# EAGLE schematic distortion3 (EAGLE 8.5.1)
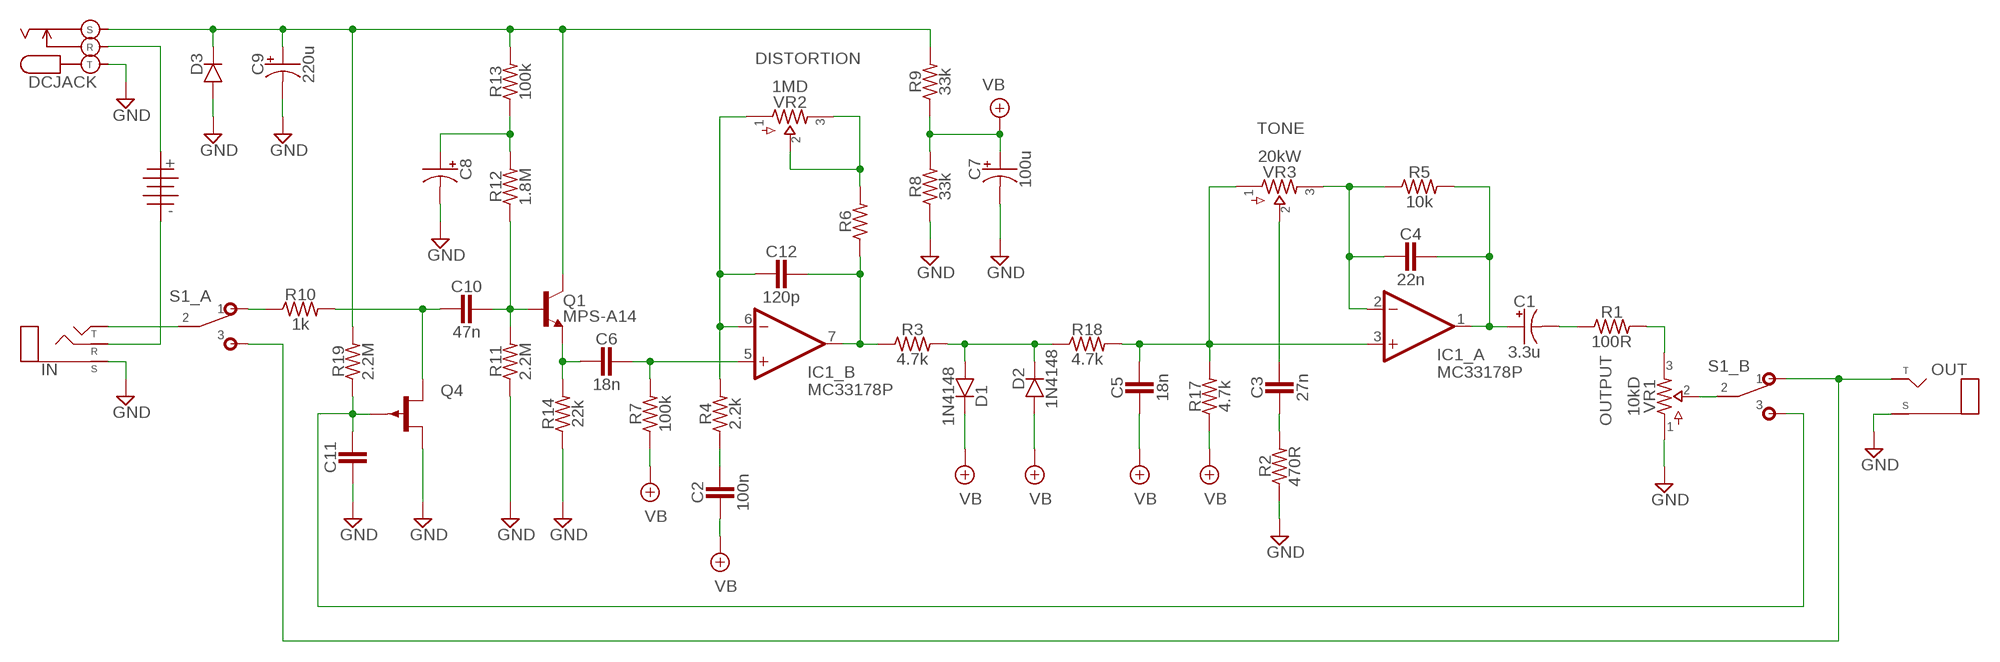
[diagram p0: schematic, sheet 1]

## Parts
BAT1  BATTERY  [TWO_PADS]
C1  3.3u  0500  [050_020]
C2  100n  CER/FILMBOX.1  [BOX_SMALL]
C3  27n  CER/FILMBOX.1  [BOX_SMALL]
C4  22n  CER/FILMBOX.1  [BOX_SMALL]
C5  18n  CER/FILMBOX.1  [BOX_SMALL]
C6  18n  CER/FILMBOX.1  [BOX_SMALL]
C7  100u  0500  [050_020]
C8  0500  [050_020]
C9  220u  0500  [050_020]
C10  47n  CER/FILMBOX.1  [BOX_SMALL]
C11  CER/FILMBOX.1  [BOX_SMALL]
C12  120p  CER/FILMBOX.1  [BOX_SMALL]
D1  1N4148  DO35.2  [DO35-2]
D2  1N4148  DO35.2  [DO35-2]
D3  DO35.2  [DO35-2]
DCJACK  DC_KOBICONN  [DC_KOBICONN]
IC1  MC33178P  DUALTH  [DIL0]
IN  STEREO  [STEREO_PCB]
OUT  MONO_JACK  [MONO_SW]
Q1  MPS-A14  2N3904  [TO92-]
Q4  2N3820  [TO92F]
R1  100R  R_.3B  [R0207/3]
R2  470R  R_.3B  [R0207/3]
R3  4.7k  R_.3B  [R0207/3]
R4  2.2k  R_.3B  [R0207/3]
R5  10k  R_.3B  [R0207/3]
R6  R_.3B  [R0207/3]
R7  100k  R_.3B  [R0207/3]
R8  33k  R_.3B  [R0207/3]
R9  33k  R_.3B  [R0207/3]
R10  1k  R_.3B  [R0207/3]
R11  2.2M  R_.3B  [R0207/3]
R12  1.8M  R_.3B  [R0207/3]
R13  100k  R_.3B  [R0207/3]
R14  22k  R_.3B  [R0207/3]
R17  4.7k  R_.3B  [R0207/3]
R18  4.7k  R_.3B  [R0207/3]
R19  2.2M  R_.3B  [R0207/3]
S1  DPDT  [DPDT]
VR1  10kD  POTS16MM  [16MM]
VR2  1MD  POTS16MM  [16MM]
VR3  20kW  POTS16MM  [16MM]

## Nets
GND: C7.- C8.- C9.- C11.2 D3.A DCJACK.T IN.P$1(S) OUT.S(SLEEVE) Q4.D R2.1 R8.1 R11.1 R14.1 VR1.1
N$1: BAT1.S IN.P$2(R)
N$2: BAT1.T DCJACK.R
N$3: IN.P$3(T) S1.A2
N$4: C9.+ D3.C DCJACK.S Q1.1(C) R9.2 R13.2 R19.2
N$5: C8.+ R12.2 R13.1
N$6: C10.1 Q1.2(B) R11.2 R12.1
N$7: C10.2 Q4.S R10.2
N$8: R10.1 S1.A1
N$9: C11.1 Q4.G R19.1 S1.B3
N$10: C6.1 Q1.3(E) R14.2
N$11: C6.2 IC1.5(_B:+IN) R7.2
N$12: C12.1 IC1.6(_B:-IN) R4.2 VR2.1
N$13: R6.2 VR2.2 VR2.3
N$14: C4.1 IC1.2(_A:-IN) R5.1 VR3.3
N$15: C12.2 IC1.7(_B:OUT) R3.1 R6.1
N$16: C1.+ C4.2 IC1.1(_A:OUT) R5.2
N$17: C2.2 R4.1
N$18: D1.A D2.C R3.2 R18.1
N$19: C5.2 IC1.3(_A:+IN) R17.2 R18.2 VR3.1
N$20: C3.2 VR3.2
N$21: C3.1 R2.2
N$22: R1.2 VR1.3
N$23: OUT.T(TIP) S1.A3 S1.B1
N$24: S1.B2 VR1.2
N$25: C1.- R1.1
VB: C2.1 C5.1 C7.+ D1.C D2.A R7.1 R8.2 R9.1 R17.1

## Notes on the sheet
- DISTORTION
- TONE
- OUTPUT

## Power pins joined to a net without a drawn wire
V+: IC1.8(_PWR:V+)
V-: IC1.4(_PWR:V-)

## Library data of the parts
BAT1 = pedals-jacks:BATTERY
C1 C7-C9 = pedals-capacitors-elec:050
C2-C6 C10-C12 = pedals-capacitors-film:CER/FILM: 47 - 120pF Xicon Ceramic Disc 2.5mm lead spacing
D1-D3 = pedals-diodes:DO35: DO-35 Package Diodes: 1N914
DCJACK = pedals-jacks:DC_KOBICONN
IC1 = pedals-integrated circuits:DUAL: OP AMP
IN = pedals-jacks:STEREO
OUT = pedals-jacks:MONO: Mono 1/4" Phone Jack
Q1 = pedals-transistors:2N3904: NPN Transistor
Q4 = transistor-small-signal:2N3820: P-CHANNEL FET
R1-R14 R17-R19 = pedals-resistors:R_
S1 = pedals-switches:DPDT
VR1-VR3 = pedals-potentiometers:POTS